# Altium schematic sheet Main.SchDoc
size A; SheetNumber: 1; SheetTotal: 4
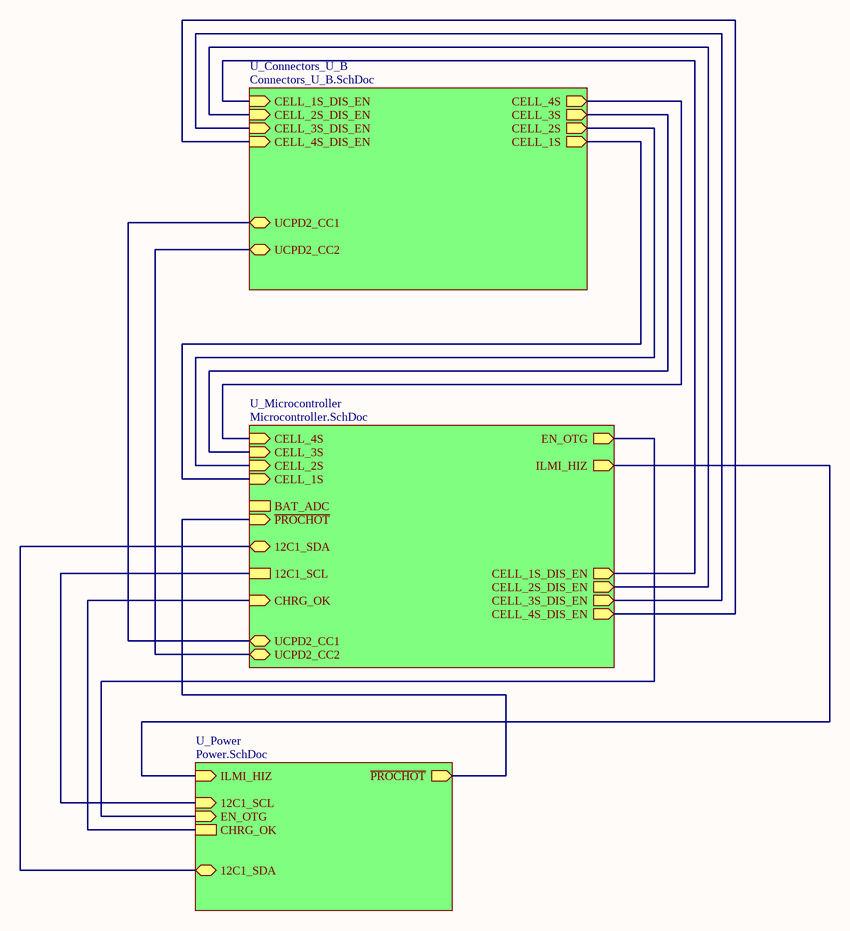
[diagram p0: Main.SchDoc]

## Sub-sheets
U_Connectors_U_B = Connectors_U_B.SchDoc: CELL_4S (out), CELL_3S (out), CELL_2S (out), CELL_1S (out), CELL_1S_DIS_EN (in), CELL_2S_DIS_EN (in), CELL_3S_DIS_EN (in), CELL_4S_DIS_EN (in), UCPD2_CC1 (bidir), UCPD2_CC2 (bidir)
U_Microcontroller = Microcontroller.SchDoc: BAT_ADC, CELL_4S (in), CELL_3S (in), CELL_2S (in), CELL_1S (in), EN_OTG (out), ~{PROCHOT} (in), CELL_3S_DIS_EN (out), CELL_4S_DIS_EN (out), ILMI_HIZ (out), CELL_2S_DIS_EN (out), CELL_1S_DIS_EN (out), 12C1_SDA (bidir), 12C1_SCL, CHRG_OK (in), UCPD2_CC1 (bidir), UCPD2_CC2 (bidir)
U_Power = Power.SchDoc: ILMI_HIZ (in), ~{PROCHOT} (out), 12C1_SDA (bidir), 12C1_SCL (in), EN_OTG (in), CHRG_OK

## Nets
(unnamed): sheet U_Connectors_U_B/CELL_4S, sheet U_Microcontroller/CELL_4S
(unnamed): sheet U_Connectors_U_B/CELL_3S, sheet U_Microcontroller/CELL_3S
(unnamed): sheet U_Connectors_U_B/CELL_2S, sheet U_Microcontroller/CELL_2S
(unnamed): sheet U_Connectors_U_B/CELL_1S, sheet U_Microcontroller/CELL_1S
(unnamed): sheet U_Connectors_U_B/CELL_1S_DIS_EN, sheet U_Microcontroller/CELL_1S_DIS_EN
(unnamed): sheet U_Connectors_U_B/CELL_2S_DIS_EN, sheet U_Microcontroller/CELL_2S_DIS_EN
(unnamed): sheet U_Connectors_U_B/CELL_3S_DIS_EN, sheet U_Microcontroller/CELL_3S_DIS_EN
(unnamed): sheet U_Connectors_U_B/CELL_4S_DIS_EN, sheet U_Microcontroller/CELL_4S_DIS_EN
(unnamed): sheet U_Connectors_U_B/UCPD2_CC1, sheet U_Microcontroller/UCPD2_CC1
(unnamed): sheet U_Connectors_U_B/UCPD2_CC2, sheet U_Microcontroller/UCPD2_CC2
(unnamed): sheet U_Microcontroller/EN_OTG, sheet U_Power/EN_OTG
(unnamed): sheet U_Microcontroller/~{PROCHOT}, sheet U_Power/~{PROCHOT}
(unnamed): sheet U_Microcontroller/ILMI_HIZ, sheet U_Power/ILMI_HIZ
(unnamed): sheet U_Microcontroller/12C1_SDA, sheet U_Power/12C1_SDA
(unnamed): sheet U_Microcontroller/12C1_SCL, sheet U_Power/12C1_SCL
(unnamed): sheet U_Microcontroller/CHRG_OK, sheet U_Power/CHRG_OK